# EAGLE schematic limitswitched_opto (EAGLE 8.0.1)
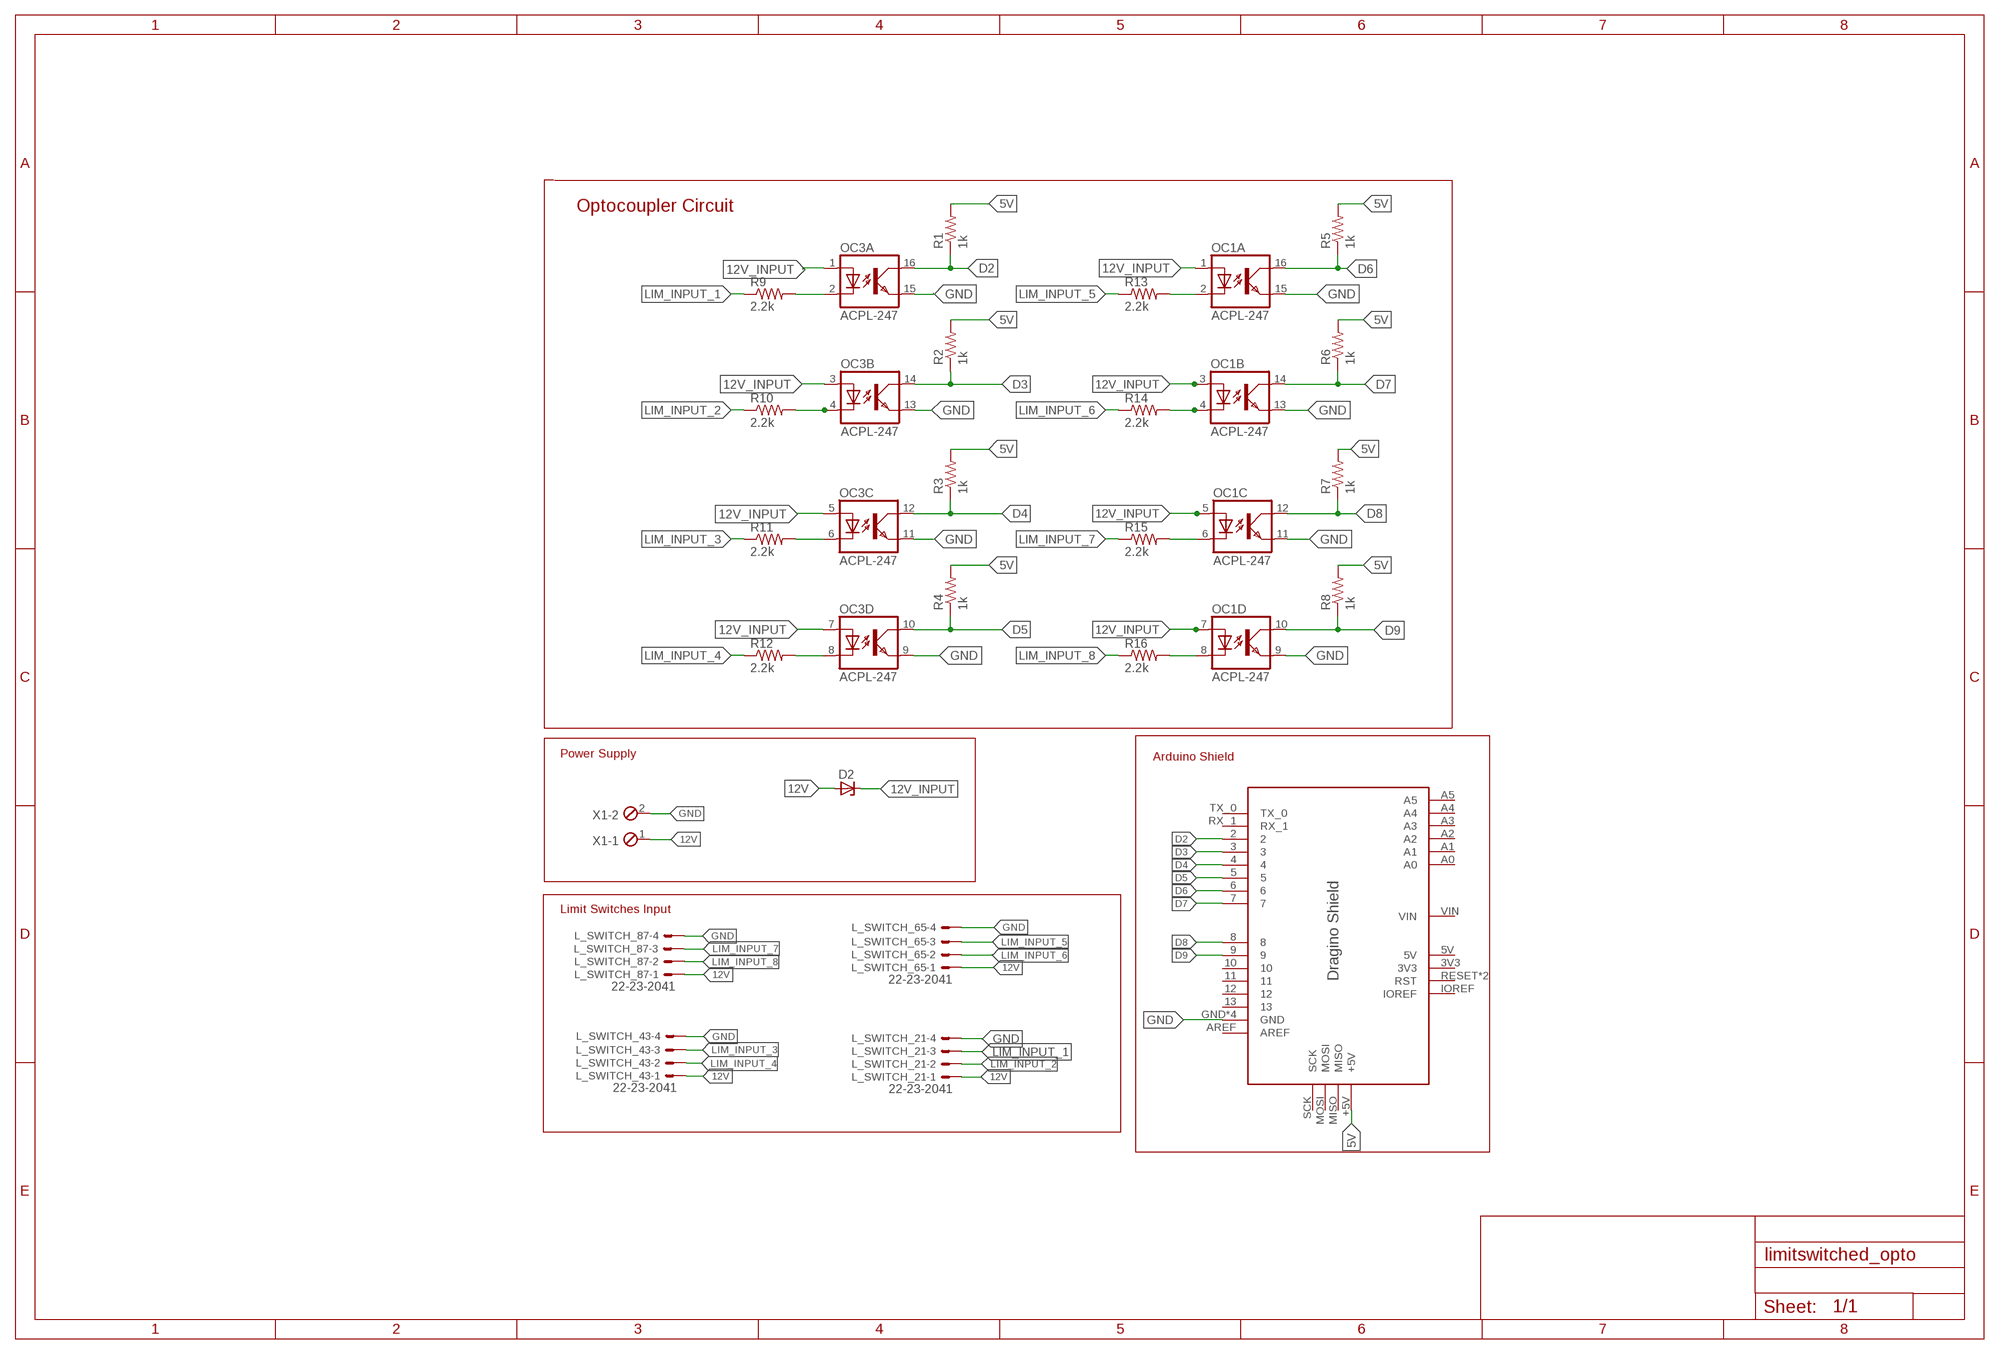
[diagram p0: schematic, sheet 1]

## Parts
D2  1SMA5925BT3G  [DO214AC]
L_SWITCH_21  22-23-2041  [22-23-2041]
L_SWITCH_43  22-23-2041  [22-23-2041]
L_SWITCH_65  22-23-2041  [22-23-2041]
L_SWITCH_87  22-23-2041  [22-23-2041]
OC1  ACPL-247  [SOP16]
OC3  ACPL-247  [SOP16]
R1  1k  R-US_R0603  [R0603]
R2  1k  R-US_R0603  [R0603]
R3  1k  R-US_R0603  [R0603]
R4  1k  R-US_R0603  [R0603]
R5  1k  R-US_R0603  [R0603]
R6  1k  R-US_R0603  [R0603]
R7  1k  R-US_R0603  [R0603]
R8  1k  R-US_R0603  [R0603]
R9  2.2k  R-US_R0603  [R0603]
R10  2.2k  R-US_R0603  [R0603]
R11  2.2k  R-US_R0603  [R0603]
R12  2.2k  R-US_R0603  [R0603]
R13  2.2k  R-US_R0603  [R0603]
R14  2.2k  R-US_R0603  [R0603]
R15  2.2k  R-US_R0603  [R0603]
R16  2.2k  R-US_R0603  [R0603]
U$1  DRAGINO_SHIELD  [DRAGINO_SHIELD]
X1  MPT2  [2POL254]

## Nets
5V: R1.2 R2.2 R3.2 R4.2 R5.2 R6.2 R7.2 R8.2 U$1.+5V
12V: D2.A L_SWITCH_21.1 L_SWITCH_43.1 L_SWITCH_65.1 L_SWITCH_87.1 X1.1
12V_INPUT: D2.C OC1.1(A:A) OC1.3(B:A) OC1.5(C:A) OC1.7(D:A) OC3.1(A:A) OC3.3(B:A) OC3.5(C:A) OC3.7(D:A)
D2: OC3.16(A:COL) R1.1 U$1.2
D3: OC3.14(B:COL) R2.1 U$1.3
D4: OC3.12(C:COL) R3.1 U$1.4
D5: OC3.10(D:COL) R4.1 U$1.5
D6: OC1.16(A:COL) R5.1 U$1.6
D7: OC1.14(B:COL) R6.1 U$1.7
D8: OC1.12(C:COL) R7.1 U$1.8
D9: OC1.10(D:COL) R8.1 U$1.9
GND: L_SWITCH_21.4 L_SWITCH_43.4 L_SWITCH_65.4 L_SWITCH_87.4 OC1.9(D:EMIT) OC1.11(C:EMIT) OC1.13(B:EMIT) OC1.15(A:EMIT) OC3.9(D:EMIT) OC3.11(C:EMIT) OC3.13(B:EMIT) OC3.15(A:EMIT) U$1.GND U$1.GND@1(GND) U$1.GND@2(GND) U$1.GND@3(GND) X1.2
LIM_INPUT_1: L_SWITCH_21.3 R9.1
LIM_INPUT_2: L_SWITCH_21.2 R10.1
LIM_INPUT_3: L_SWITCH_43.3 R11.1
LIM_INPUT_4: L_SWITCH_43.2 R12.1
LIM_INPUT_5: L_SWITCH_65.3 R13.1
LIM_INPUT_6: L_SWITCH_65.2 R14.1
LIM_INPUT_7: L_SWITCH_87.3 R15.1
LIM_INPUT_8: L_SWITCH_87.2 R16.1
N$5: OC1.2(A:C) R13.2
N$6: OC1.4(B:C) R14.2
N$7: OC1.6(C:C) R15.2
N$8: OC1.8(D:C) R16.2
N$9: OC3.6(C:C) R11.2
N$14: OC3.8(D:C) R12.2
N$23: OC3.2(A:C) R9.2
N$24: OC3.4(B:C) R10.2
Unconnected: U$1.3V3 U$1.5V U$1.10 U$1.11 U$1.12 U$1.13 U$1.A0 U$1.A1 U$1.A2 U$1.A3 U$1.A4 U$1.A5 U$1.AREF U$1.IOREF U$1.MISO U$1.MOSI U$1.RESET(RST) U$1.RST U$1.RX_1 U$1.SCK U$1.TX_0 U$1.VIN

## Notes on the sheet
- Optocoupler Circuit
- Power Supply | Arduino Shield
- Limit Switches Input

## Library data of the parts
D2 = 1sma59xx_10:1SMA59*BT3G: 1SMA59xxBT3G Series 1.5 Watt Plastic Surface Mount Zener Voltage Regulators Source: http://www.onsemi.com/pub_link/Collateral/1SMA5913BT3-D.PDF; MF: ON Semiconductor; MPN: 1SMA5925BT3G; OC_FARNELL: 1431147; OC_NEWARK: 71J9198
L_SWITCH_21 L_SWITCH_43 L_SWITCH_65 L_SWITCH_87 = con-molex:22-23-2041: .100" (2.54mm) Center Header - 4 Pin; MF: MOLEX; MPN: 22-23-2041; OC_FARNELL: 1462920; OC_NEWARK: 38C0355
OC1 OC3 = avago:ACPL-247
R1-R16 = rcl:R-US_: RESISTOR, American symbol
U$1 = Dragino_shield:DRAGINO_SHIELD
X1 = con-phoenix-254:MPT2: PHOENIX CONNECTOR; OC_FARNELL: unknown; OC_NEWARK: unknown